# Altium project arduino-nano.PrjPcb
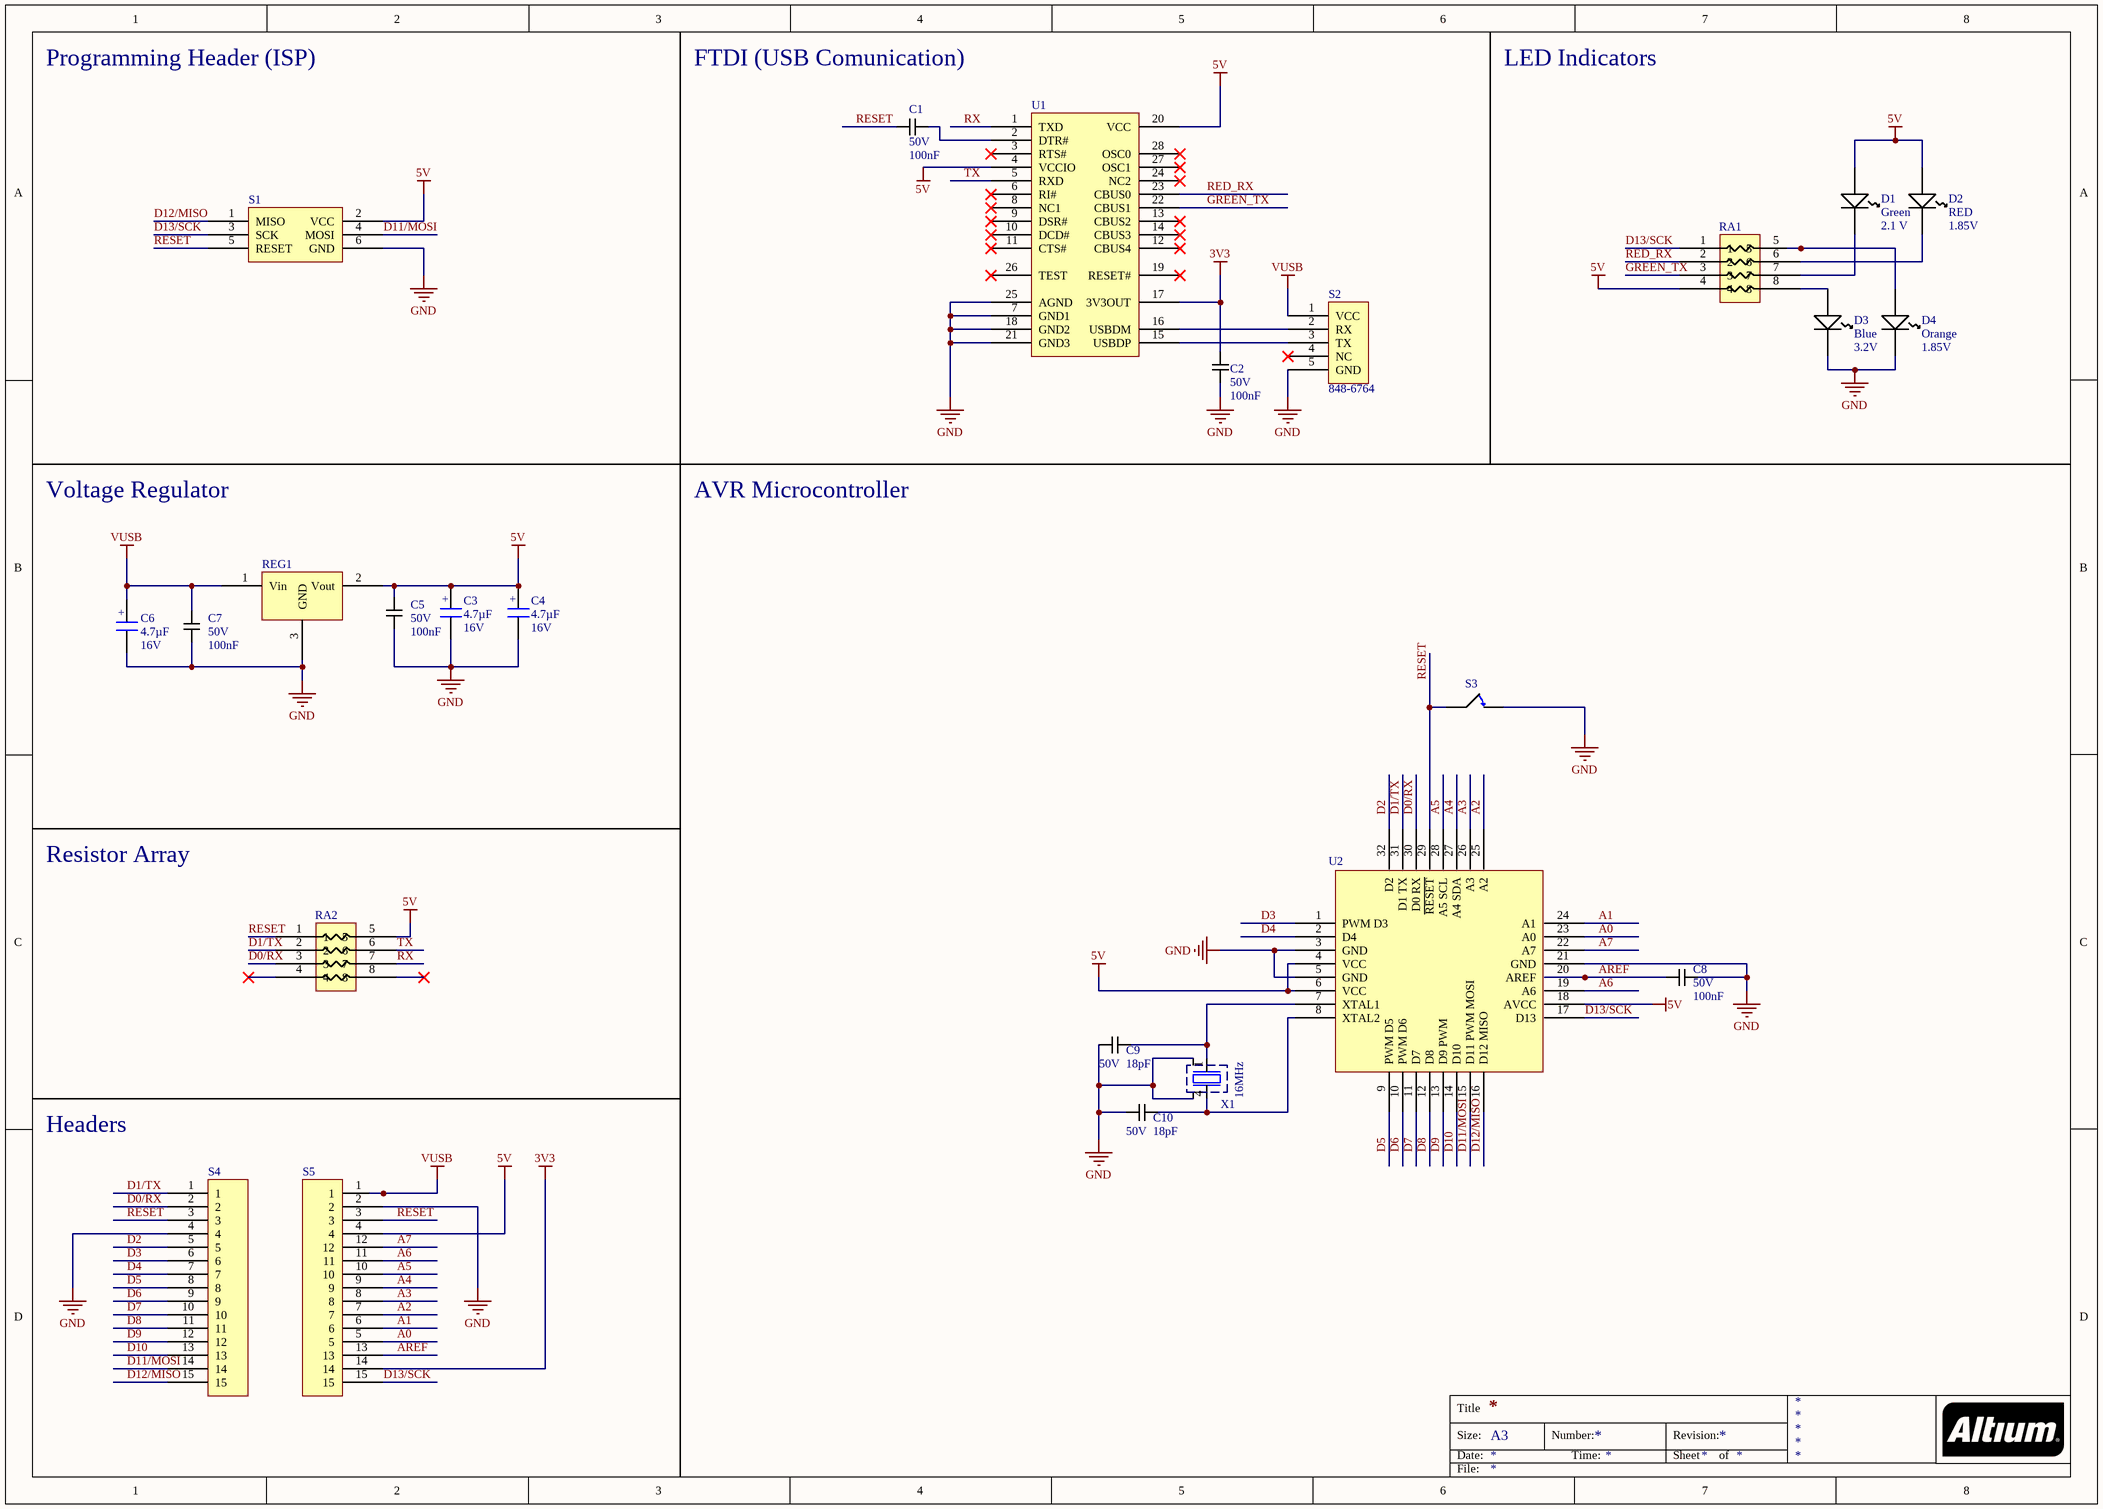
[diagram p0: arduino-nano.SchDoc]
1 sheet, 25 parts. Net scope: global (net labels, ports and power ports of the same name join across sheets).
Board files: arduino-nano.PcbDoc, arduino-nano_v1.PcbDoc, arduino-nano_v2.PcbDoc

## Sheet arduino-nano.SchDoc
size A3

### Parts
C1  Voltage: 50V  Capacitance: 100nF  [CAPCP2012X09N]  (hidden comment: 100nF Ceramic Multilayer Capacitor_1)
C2  Voltage: 50V  Capacitance: 100nF  [CAPCP2012X09N]  (hidden comment: 100nF Ceramic Multilayer Capacitor_1)
C3  value 4.7µF  Voltage: 16V  [CASE A - 3216X18]  (hidden comment: Capacitor SMT Tantalum)
C4  value 4.7µF  Voltage: 16V  [CASE A - 3216X18]  (hidden comment: Capacitor SMT Tantalum)
C5  Voltage: 50V  Capacitance: 100nF  [CAPCP2012X09N]  (hidden comment: 100nF Ceramic Multilayer Capacitor_1)
C6  value 4.7µF  Voltage: 16V  [CASE A - 3216X18]  (hidden comment: Capacitor SMT Tantalum)
C7  Voltage: 50V  Capacitance: 100nF  [CAPCP2012X09N]  (hidden comment: 100nF Ceramic Multilayer Capacitor_1)
C8  Voltage: 50V  Capacitance: 100nF  [CAPCP2012X09N]  (hidden comment: 100nF Ceramic Multilayer Capacitor_1)
C9  Voltage: 50V  Capacitance: 18pF  [CAPCP2012X09N]  (hidden comment: C0805C180J5GACTU)
C10  Voltage: 50V  Capacitance: 18pF  [CAPCP2012X09N]  (hidden comment: C0805C180J5GACTU)
D1  Color: Green  Forward Voltage: 2.1 V  [LED1913X12NGREEN]  (hidden comment: Kingbright Green LED, 70 mcd 120 ° 0805)
D2  Color: RED  Forward Voltage: 1.85V  [LED1913X12NRED]  (hidden comment: Kingbright Red LED, 100 mcd 120 ° 0805)
D3  Color: Blue  Forward Voltage: 3.2V  [LED1913X12NBLUE]  (hidden comment: Kingbright Blue LED, 60 mcd 120 ° 0805)
D4  Color: Orange  Forward Voltage: 1.85V  [LED1913X12NYEL/ORANGE]  (hidden comment: Kingbright Orange LED, 200 mcd 120 ° 0805)
RA1  1k +- 5% SMT Resistor Array  [1206 RA]  (value not drawn)
RA2  1k +- 5% SMT Resistor Array  [1206 RA]  (value not drawn)
REG1  LM1117MP-5.0/NOPB, Low Dropout Voltage Regulator, 1.5A, 5 V ±1%, 4-Pin SOT-223  [SOT230P700X180-4N]  (value not drawn)
S1  Programming Headers Dual Row  [ISP HEADER]  (value not drawn)
S2  RS Stock No: 848-6764  [MicroUSB]  (hidden comment: NewMolex Right Angle SMT Female Type B Micro USB Connector, 30 V ac, 1.8A)
S3  Tactile Switch SPST- NO 0.05A @24V  [Button8014X17N]  (value not drawn)
S4  connector;str header;single row;.1 cont centers;.095 tail;gold or gtx;36 contact  [Header]  (value not drawn)
S5  connector;str header;single row;.1 cont centers;.095 tail;gold or gtx;36 contact  [Header]  (value not drawn)
U1  FT232RL, Universal Asynchronous Receiver & Transmitter 3MBd, 28-Pin, SSOP  [SOP65P780X200-28N]  (value not drawn)
U2  ATMEGA328P-AU  [TQFP80P900X900X120-32N]  (value not drawn)
X1  value 16MHz  [Aker S5C Crystal]  (hidden comment: Aker 16MHz Crystal SMT)

### Nets
3V3: C2.2 S5.14 U1.17(3V3OUT)
5V: C3.1 C4.1 C5.2 D1.1(A) D2.1(A) RA1.4 RA2.5 REG1.2(Vout) S1.2(VCC) S5.4 U1.4(VCCIO) U1.20(VCC) U2.4(VCC) U2.6(VCC) U2.18(AVCC)
GND: C2.1 C3.2 C4.2 C5.1 C6.2 C7.1 C8.2 C9.2 C10.2 D3.2(K) D4.2(K) REG1.3(GND) S1.6(GND) S2.5(GND) S3.1 S4.4 S5.2 U1.7(GND1) U1.18(GND2) U1.21(GND3) U1.25(AGND) U2.3(GND) U2.5(GND) U2.21(GND) X1.2(Gnd) X1.3(Gnd)
VUSB: C6.1 C7.2 REG1.1(Vin) S2.1(VCC) S5.1
A0: S5.5 U2.23(A0)
A1: S5.6 U2.24(A1)
A2: S5.7 U2.25(A2)
A3: S5.8 U2.26(A3)
A4: S5.9 U2.27(A4_SDA)
A5: S5.10 U2.28(A5_SCL)
A6: S5.11 U2.19(A6)
A7: S5.12 U2.22(A7)
AREF: C8.1 S5.13 U2.20(AREF)
D0/RX: RA2.3 S4.2 U2.30(D0_RX)
D1/TX: RA2.2 S4.1 U2.31(D1_TX)
D2: S4.5 U2.32(D2)
D3: S4.6 U2.1(PWM_D3)
D4: S4.7 U2.2(D4)
D5: S4.8 U2.9(PWM_D5)
D6: S4.9 U2.10(PWM_D6)
D7: S4.10 U2.11(D7)
D8: S4.11 U2.12(D8)
D9: S4.12 U2.13(D9_PWM)
D10: S4.13 U2.14(D10)
D11/MOSI: S1.4(MOSI) S4.14 U2.15(D11_PWM_MOSI)
D12/MISO: S1.1(MISO) S4.15 U2.16(D12_MISO)
D13/SCK: RA1.1 S1.3(SCK) S5.15 U2.17(D13)
GREEN_TX: RA1.3 U1.22(CBUS1)
RED_RX: RA1.2 U1.23(CBUS0)
RESET: C1.1 RA2.1 S1.5(RESET) S3.2 S4.3 S5.3 U2.29(~{RESET})
RX: RA2.7 U1.1(TXD)
TX: RA2.6 U1.5(RXD)
NetC1_2: C1.2 U1.2(DTR#)
NetC9_1: C9.1 U2.7(XTAL1) X1.1
NetC10_1: C10.1 U2.8(XTAL2) X1.4
NetD1_2: D1.2(K) RA1.7
NetD2_2: D2.2(K) RA1.6
NetD3_1: D3.1(A) RA1.8
NetD4_1: D4.1(A) RA1.5
NetS2_2: S2.2(RX) U1.16(USBDM)
NetS2_3: S2.3(TX) U1.15(USBDP)

Not connected (* = marked no-connect by the designer): RA2 4* 8*; S2 4(NC)*; U1 3(RTS#)* 6(RI#)* 8(NC1)* 9(DSR#)* 10(DCD#)* 11(CTS#)* 12(CBUS4)* 13(CBUS2)* 14(CBUS3)* 19(RESET#)* 24(NC2)* 26(TEST)* 27(OSC1)* 28(OSC0)*

### Notes on the sheet
- Programming Header (ISP)
- FTDI (USB Comunication)
- LED Indicators
- Voltage Regulator
- AVR Microcontroller
- Resistor Array
- Headers
- Title
- Size:
- Date:
- A3
- Number:
- Time:
- Revision:
- Sheet
- of
- File:
- (in symbol 4.7µF Tant RS 496-3545) +

### Library data of the parts
C1 C2 C5 C7 C8 = 100nF Ceramic Multilayer Capacitor_1: AVX 0805 Standard 100nF Ceramic Multilayer Capacitor, 50 V dc X7R Dielectric ±10% SMD; Creator: Ritesh Kanjee; Date Created: 18 February 2015; Package: 0805; Manufacturer: AVX; RS Stock No.: 464-6688; Datasheet URL: http://za.rs-online.com/web/p/ceramic-multilayer-capacitors/4646688/
C3 C4 C6 = 4.7µF Tant RS 496-3545: Capacitor,tantalum,SMT,16V,4.7uF,10%,A-case; Part Originator: H Theron; RS Stock Nr.: 496-3545; Tolerance: 10%; Package: 3216-18; Publisher: DPSS; LatestRevisionDate: 28-April-2010; ComponentLink1Description: Supplier Website; ComponentLink1URL: http://za.rs-online.com/web/search/searchBrowseAction.html?method=getProduct&R=4963545; ComponentLink2Description: RS Data sheet; ComponentLink2URL: http://docs-europe.origin.electrocomponents.com/webdocs/04ed/0900766b804ed4cc.pdf
C9 C10 = 18pF Ceramic Multilayer Capacitor, 50 V dc C0G Dielectric ±5% SMD: Manufacturer: Kemet; Creator: Ritesh Kanjee; Date Created: 18 February 2015; Package: 0805; RS Stock No.: 648-0935; Datasheet URL: http://za.rs-online.com/web/p/ceramic-multilayer-capacitors/6480935/?searchTerm=C0805C180J5GACTU&relevancy-data=636F3D3226696E3D4931384E4B6E6F776E41734D504E266C753D656E266D6D3D6D61746368616C6C7061727469616C26706D3D5E5B5C707B4C7D5C707B4E647D2D2C2F255C2E5D2B2426706F3D313326736E3D592673743D4D414E5F504152545F4E554D4245522677633D424F5448267573743D4330383035433138304A35474143545526
D1 = Kingbright Green LED, 70 mcd 120 ° 0805: Manufacturer Part No.: KP-2012MGC; Creator: Ritesh Kanjee; Date Created: 18 February 2015; Manufacturer: KingBright; RS Stock No.: 466-3778; Datasheet URL: http://za.rs-online.com/web/p/visible-leds/4663778/
D2 = Kingbright Red LED, 100 mcd 120 ° 0805: Manufacturer Part No.: KP-2012SRC-PRV; Creator: Ritesh Kanjee; Date Created: 18 February 2015; Manufacturer: KingBright; RS Stock No.: 466-3813; Datasheet URL: http://za.rs-online.com/web/p/visible-leds/4663813/
D3 = Kingbright Blue LED, 60 mcd 120 ° 0805: Manufacturer Part No.: KP-2012PBC-A; Creator: Ritesh Kanjee; Date Created: 18 February 2015; Manufacturer: KingBright; RS Stock No.: 466-3784; Datasheet URL: http://za.rs-online.com/web/p/visible-leds/4663784/
D4 = Kingbright Orange LED, 200 mcd 120 ° 0805: Manufacturer Part No.: KP-2012SEC; Creator: Ritesh Kanjee; Date Created: 18 February 2015; Manufacturer: KingBright; RS Stock No.: 466-3790; Datasheet URL: http://za.rs-online.com/web/p/visible-leds/4663790/
RA1 RA2 = 1k +- 5% SMT Resistor Array: 1k +- 5% SMT Resistor Array 4 Res; Manufacturer: Bourns; Manufacturer Part No.: CAY16-102J4LF; Wattage: 0.25W; Creator: R Kanjee; RS Stock No.: 552-5579; Date Created: 25 February 2015
REG1 = LM1117MP-5.0: Manufacturer: Texas Instruments; Supply Current: 1.5Amps; Output Voltage: 5V; Maximum Input Voltage: 15V; Date Created: 26 February 2015; Created By: R Kanjee; RS Stock No.: 533-9583; Datasheet URL: http://za.rs-online.com/web/p/low-dropout-voltage-regulators/5339583/
S1 = Programming ISP, Programming Headers Dual Row: Manufacturer: FCI; Manufacturer Part No.: 68000-236HLF; Current Rating: 3Amps Continuous; Created By: R Kanjee; Date Created: 1 March 2015; RS Stock No.: 2509565626
S2 = Micro USB Connector, 30 V ac, 1.8A: Manufacturer: Molex; Manufacturer Part No.: 105017-0001; Max Voltage: 30V; Creator: R Kanjee; Date Created: 28 February 2015; Datasheet URL: http://za.rs-online.com/web/p/micro-usb-connectors/8486764/; Max Current: 1.8A
S3 = Tactile Switch SPST- NO 0.05A @24V: Manufacturer: Omron; Manufacturer Part No.: B3F1000; State: Normaly Open; Date Created: 25 February 2015; Creator: R Kanjee; RS Stock No.: 686-6847
S4 S5 = Single row; PCB headers: Manufacturer: FCI; Manufacturer Part No.: 68000-236HLF; Current Rating: 3Amps Continuous; Created By: R Kanjee; Date Created: 1 March 2015; RS Stock No.: 2509565626
U1 = FT232RL USB to UART, Universal Asynchronous Receiver & Transmitter 3MBd, 28-Pin, SSOP: Manufacturer: FTDI Chip; Creator: R Kanjee; Date Created: 03 March 2015; Manufacturer Part No.: FT232RL; RS Stock No.: 406-580; Pin Count: 28
U2 = ATMEGA328P-AU: Microchip ATMEGA328P-AU, 8bit AVR Microcontroller, 20MHz, 1 kB, 32 kB Flash, 32-Pin TQFP; Company: ComputeChip; Created By: Rajiv Bishwokarma; Date Created: December 31, 2020; RS Stock No.: 696-3092; Datasheet URL: https://docs.rs-online.com/5775/0900766b80db4deb.pdf
X1 = Aker  C5S-16.000-12-3030-X: Aker S5C SMT Crystal; Load Capacitance: 12pF; Frequency Stability: +/-30ppm; RS: RS 671-9488; Creator: R Kanjee; Manufacturer: Aker; Manufacturer Part #: C5S-16.000-12-3030-X; Supplier: RS; RS Stock Nr.: 671-9488; HelpURL: http://za.rs-online.com/web/p/crystal-units/6719488/; Package: 3.2x5mm SMD